# EAGLE design ShowMeShield (EAGLE 6.6.0)
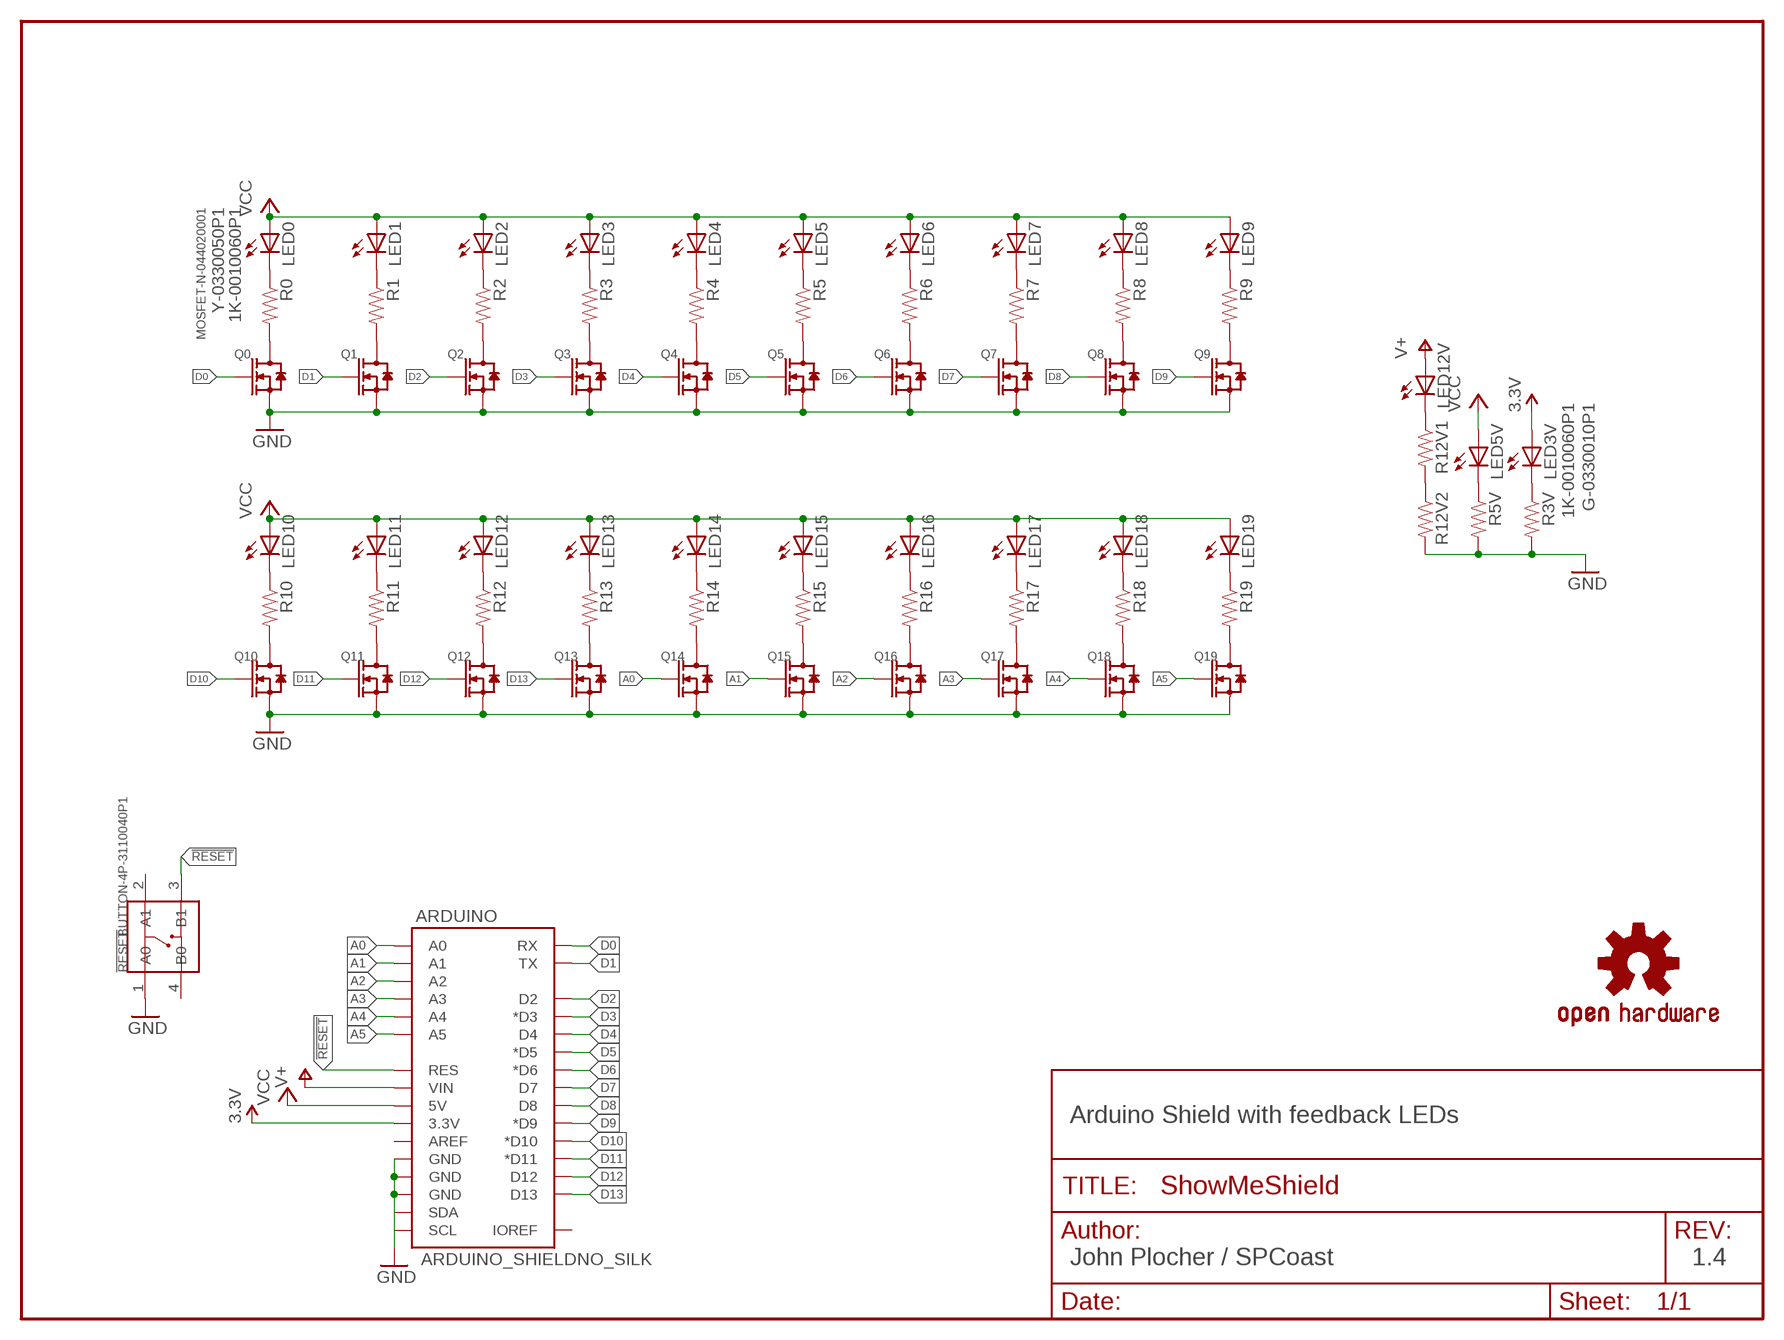
[diagram p0: schematic, sheet 1]

## Parts
!RESET  BUTTON-4P-3110040P1  [4P-6.0X6.0X5.0H]
ARDUINO  ARDUINO_SHIELDNO_SILK  [DUEMILANOVE_VIAS]
LED0  Y-0330050P1  LEDCHIPLED_0603  [CHIPLED_0603]
LED1  Y-0330050P1  LEDCHIPLED_0603  [CHIPLED_0603]
LED2  Y-0330050P1  LEDCHIPLED_0603  [CHIPLED_0603]
LED3  Y-0330050P1  LEDCHIPLED_0603  [CHIPLED_0603]
LED3V  G-0330010P1  LEDCHIPLED_0603  [CHIPLED_0603]
LED4  Y-0330050P1  LEDCHIPLED_0603  [CHIPLED_0603]
LED5  Y-0330050P1  LEDCHIPLED_0603  [CHIPLED_0603]
LED5V  G-0330010P1  LEDCHIPLED_0603  [CHIPLED_0603]
LED6  Y-0330050P1  LEDCHIPLED_0603  [CHIPLED_0603]
LED7  Y-0330050P1  LEDCHIPLED_0603  [CHIPLED_0603]
LED8  Y-0330050P1  LEDCHIPLED_0603  [CHIPLED_0603]
LED9  Y-0330050P1  LEDCHIPLED_0603  [CHIPLED_0603]
LED10  Y-0330050P1  LEDCHIPLED_0603  [CHIPLED_0603]
LED11  Y-0330050P1  LEDCHIPLED_0603  [CHIPLED_0603]
LED12  Y-0330050P1  LEDCHIPLED_0603  [CHIPLED_0603]
LED12V  G-0330010P1  LEDCHIPLED_0603  [CHIPLED_0603]
LED13  Y-0330050P1  LEDCHIPLED_0603  [CHIPLED_0603]
LED14  Y-0330050P1  LEDCHIPLED_0603  [CHIPLED_0603]
LED15  Y-0330050P1  LEDCHIPLED_0603  [CHIPLED_0603]
LED16  Y-0330050P1  LEDCHIPLED_0603  [CHIPLED_0603]
LED17  Y-0330050P1  LEDCHIPLED_0603  [CHIPLED_0603]
LED18  Y-0330050P1  LEDCHIPLED_0603  [CHIPLED_0603]
LED19  Y-0330050P1  LEDCHIPLED_0603  [CHIPLED_0603]
Q0  MOSFET-N-044020001  [SOT23]
Q1  MOSFET-N-044020001  [SOT23]
Q2  MOSFET-N-044020001  [SOT23]
Q3  MOSFET-N-044020001  [SOT23]
Q4  MOSFET-N-044020001  [SOT23]
Q5  MOSFET-N-044020001  [SOT23]
Q6  MOSFET-N-044020001  [SOT23]
Q7  MOSFET-N-044020001  [SOT23]
Q8  MOSFET-N-044020001  [SOT23]
Q9  MOSFET-N-044020001  [SOT23]
Q10  MOSFET-N-044020001  [SOT23]
Q11  MOSFET-N-044020001  [SOT23]
Q12  MOSFET-N-044020001  [SOT23]
Q13  MOSFET-N-044020001  [SOT23]
Q14  MOSFET-N-044020001  [SOT23]
Q15  MOSFET-N-044020001  [SOT23]
Q16  MOSFET-N-044020001  [SOT23]
Q17  MOSFET-N-044020001  [SOT23]
Q18  MOSFET-N-044020001  [SOT23]
Q19  MOSFET-N-044020001  [SOT23]
R0  1K-0010060P1  RESISTOR0603-RES  [0603-RES]
R1  1K-0010060P1  RESISTOR0603-RES  [0603-RES]
R2  1K-0010060P1  RESISTOR0603-RES  [0603-RES]
R3  1K-0010060P1  RESISTOR0603-RES  [0603-RES]
R3V  1K-0010060P1  RESISTOR0603-RES  [0603-RES]
R4  1K-0010060P1  RESISTOR0603-RES  [0603-RES]
R5  1K-0010060P1  RESISTOR0603-RES  [0603-RES]
R5V  1K-0010060P1  RESISTOR0603-RES  [0603-RES]
R6  1K-0010060P1  RESISTOR0603-RES  [0603-RES]
R7  1K-0010060P1  RESISTOR0603-RES  [0603-RES]
R8  1K-0010060P1  RESISTOR0603-RES  [0603-RES]
R9  1K-0010060P1  RESISTOR0603-RES  [0603-RES]
R10  1K-0010060P1  RESISTOR0603-RES  [0603-RES]
R11  1K-0010060P1  RESISTOR0603-RES  [0603-RES]
R12  1K-0010060P1  RESISTOR0603-RES  [0603-RES]
R12V1  1K-0010060P1  RESISTOR0603-RES  [0603-RES]
R12V2  1K-0010060P1  RESISTOR0603-RES  [0603-RES]
R13  1K-0010060P1  RESISTOR0603-RES  [0603-RES]
R14  1K-0010060P1  RESISTOR0603-RES  [0603-RES]
R15  1K-0010060P1  RESISTOR0603-RES  [0603-RES]
R16  1K-0010060P1  RESISTOR0603-RES  [0603-RES]
R17  1K-0010060P1  RESISTOR0603-RES  [0603-RES]
R18  1K-0010060P1  RESISTOR0603-RES  [0603-RES]
R19  1K-0010060P1  RESISTOR0603-RES  [0603-RES]
U$1  OSHW-LOGOM  [OSHW-LOGO-M]

## Nets
3.3V [Power]: ARDUINO.3.3V LED3V.A
!RESET: !RESET.3(B1) ARDUINO.RES
A0: ARDUINO.A0 Q14.1(G)
A1: ARDUINO.A1 Q15.1(G)
A2: ARDUINO.A2 Q16.1(G)
A3: ARDUINO.A3 Q17.1(G)
A4: ARDUINO.A4 Q18.1(G)
A5: ARDUINO.A5 Q19.1(G)
D0: ARDUINO.RX Q0.1(G)
D1: ARDUINO.TX Q1.1(G)
D2: ARDUINO.D2 Q2.1(G)
D3: ARDUINO.D3(*D3) Q3.1(G)
D4: ARDUINO.D4 Q4.1(G)
D5: ARDUINO.D5(*D5) Q5.1(G)
D6: ARDUINO.D6(*D6) Q6.1(G)
D7: ARDUINO.D7 Q7.1(G)
D8: ARDUINO.D8 Q8.1(G)
D9: ARDUINO.D9(*D9) Q9.1(G)
D10: ARDUINO.D10(*D10) Q10.1(G)
D11: ARDUINO.D11(*D11) Q11.1(G)
D12: ARDUINO.D12 Q12.1(G)
D13: ARDUINO.D13 Q13.1(G)
GND [Power]: !RESET.1(A0) ARDUINO.GND@0(GND) ARDUINO.GND@1(GND) ARDUINO.GND@2(GND) Q0.2(S) Q1.2(S) Q2.2(S) Q3.2(S) Q4.2(S) Q5.2(S) Q6.2(S) Q7.2(S) Q8.2(S) Q9.2(S) Q10.2(S) Q11.2(S) Q12.2(S) Q13.2(S) Q14.2(S) Q15.2(S) Q16.2(S) Q17.2(S) Q18.2(S) Q19.2(S) R3V.2 R5V.2 R12V2.2
N$1: LED3V.C R3V.1
N$2: LED1.C R1.1
N$3: LED2.C R2.1
N$4: LED3.C R3.1
N$5: LED4.C R4.1
N$6: LED5.C R5.1
N$7: LED6.C R6.1
N$8: LED5V.C R5V.1
N$9: LED7.C R7.1
N$10: R12V1.2 R12V2.1
N$11: LED8.C R8.1
N$12: LED9.C R9.1
N$13: LED10.C R10.1
N$14: LED11.C R11.1
N$15: LED12.C R12.1
N$16: LED13.C R13.1
N$17: LED14.C R14.1
N$18: LED15.C R15.1
N$19: LED16.C R16.1
N$20: LED17.C R17.1
N$21: LED18.C R18.1
N$22: LED19.C R19.1
N$23: LED12V.C R12V1.1
N$28: LED0.C R0.1
N$29: Q0.3(D) R0.2
N$30: Q1.3(D) R1.2
N$31: Q2.3(D) R2.2
N$32: Q3.3(D) R3.2
N$33: Q4.3(D) R4.2
N$34: Q5.3(D) R5.2
N$35: Q6.3(D) R6.2
N$36: Q7.3(D) R7.2
N$37: Q8.3(D) R8.2
N$38: Q9.3(D) R9.2
N$39: Q13.3(D) R13.2
N$40: Q10.3(D) R10.2
N$41: Q11.3(D) R11.2
N$42: Q12.3(D) R12.2
N$43: Q14.3(D) R14.2
N$44: Q15.3(D) R15.2
N$45: Q16.3(D) R16.2
N$46: Q17.3(D) R17.2
N$47: Q18.3(D) R18.2
N$48: Q19.3(D) R19.2
V+ [Power]: ARDUINO.VIN LED12V.A
VCC [Power]: ARDUINO.5V LED0.A LED1.A LED2.A LED3.A LED4.A LED5.A LED5V.A LED6.A LED7.A LED8.A LED9.A LED10.A LED11.A LED12.A LED13.A LED14.A LED15.A LED16.A LED17.A LED18.A LED19.A
Unconnected: !RESET.2(A1) !RESET.4(B0) ARDUINO.AREF ARDUINO.IOREF ARDUINO.SCL ARDUINO.SDA

## Notes on the sheet
- Arduino Shield with feedback LEDs
- John Plocher / SPCoast | 1.4

## Library data of the parts
!RESET = OPL:BUTTON-4P
ARDUINO = SPCoast:ARDUINO_SHIELD
LED0 LED1-LED3 LED3V LED4 LED5 LED5V LED6-LED12 LED12V LED13-LED19 = MCP:LED: LED OSRAM: - CHIPLED LG R971, LG N971, LY N971, LG Q971, LY Q971, LO R971, LY R971 LH N974, LH R974 LS Q976, LO Q976, LY Q976 LO Q996 - Hyper CHIPLED LW Q18S LB Q993, LB Q99A, LB R99A - SideLED LS A670, LO A670, LY A670, LG A670, LP A670 LB A673, LV A673, LT A673, LW A673 LH A674 LY A675 LS A676, LA A676, LO A676, LY A676, LW A676 LS A679, LY A679, LG A679 - Hyper Micro SIDELED® LS Y876, LA Y876, LO Y876, LY Y876 LT Y87S - SmartLED LW L88C, LW L88S LB L89C, LB L89S, LG L890 LS L89K, LO L89K, LY L89K LS L896, LA L896, LO L896, LY L896 - TOPLED LS T670, LO T670, LY T670, LG T670, LP T670 LSG T670, LSP T670, LSY T670, LOP T670, LYG T670 LG T671, LOG T671, LSG T671 LB T673, LV T673, LT T673, LW T673 LH T674 LS T676, LA T676, LO T676, LY T676, LB T676, LH T676, LSB T676, LW T676 LB T67C, LV T67C, LT T67C, LS T67K, LO T67K, LY T67K, LW E67C LS E67B, LA E67B, LO E67B, LY E67B, LB E67C, LV E67C, LT E67C LW T67C LS T679, LY T679, LG T679 LS T770, LO T770, LY T770, LG T770, LP T770 LB T773, LV T773, LT T773, LW T773 LH T774 LS E675, LA E675, LY E675, LS T675 LS T776, LA T776, LO T776, LY T776, LB T776 LHGB T686 LT T68C, LB T68C - Hyper Mini TOPLED® LB M676 - Mini TOPLED Santana® LG M470 LS M47K, LO M47K, LY M47K Source: http://www.osram.convergy.de LUXEON: - LUMILED® LXK2-PW12-R00, LXK2-PW12-S00, LXK2-PW14-U00, LXK2-PW14-V00 LXK2-PM12-R00, LXK2-PM12-S00, LXK2-PM14-U00 LXK2-PE12-Q00, LXK2-PE12-R00, LXK2-PE12-S00, LXK2-PE14-T00, LXK2-PE14-U00 LXK2-PB12-K00, LXK2-PB12-L00, LXK2-PB12-M00, LXK2-PB14-N00, LXK2-PB14-P00, LXK2-PB14-Q00 LXK2-PR12-L00, LXK2-PR12-M00, LXK2-PR14-Q00, LXK2-PR14-R00 LXK2-PD12-Q00, LXK2-PD12-R00, LXK2-PD12-S00 LXK2-PH12-R00, LXK2-PH12-S00 LXK2-PL12-P00, LXK2-PL12-Q00, LXK2-PL12-R00 Source: www.luxeon.com KINGBRIGHT: KA-3528ASYC Source: www.kingbright.com
Q0 Q1-Q19 = OPL:MOSFET-N: CJ2302：SMD MOSFET N-CH 20V-2.1A
R0 R1-R3 R3V R4 R5 R5V R6-R12 R12V1 R12V2 R13-R19 = MCP:RESISTOR: Resistor Basic schematic elements and footprints for 0603, 1206, and PTH 1/10th watt (small) resistors.
U$1 = SparkFun:OSHW-LOGO: Open Source Hardware Logo This logo indicates the piece of hardware it is found on incorporates a OSHW license and/or adheres to the definition of open source hardware found here: http://freedomdefined.org/OSHW

## Net classes
0 default: width 0.254 mm, drill 0.203 mm
1 Power: width 0.305 mm, drill 0.203 mm

## Board
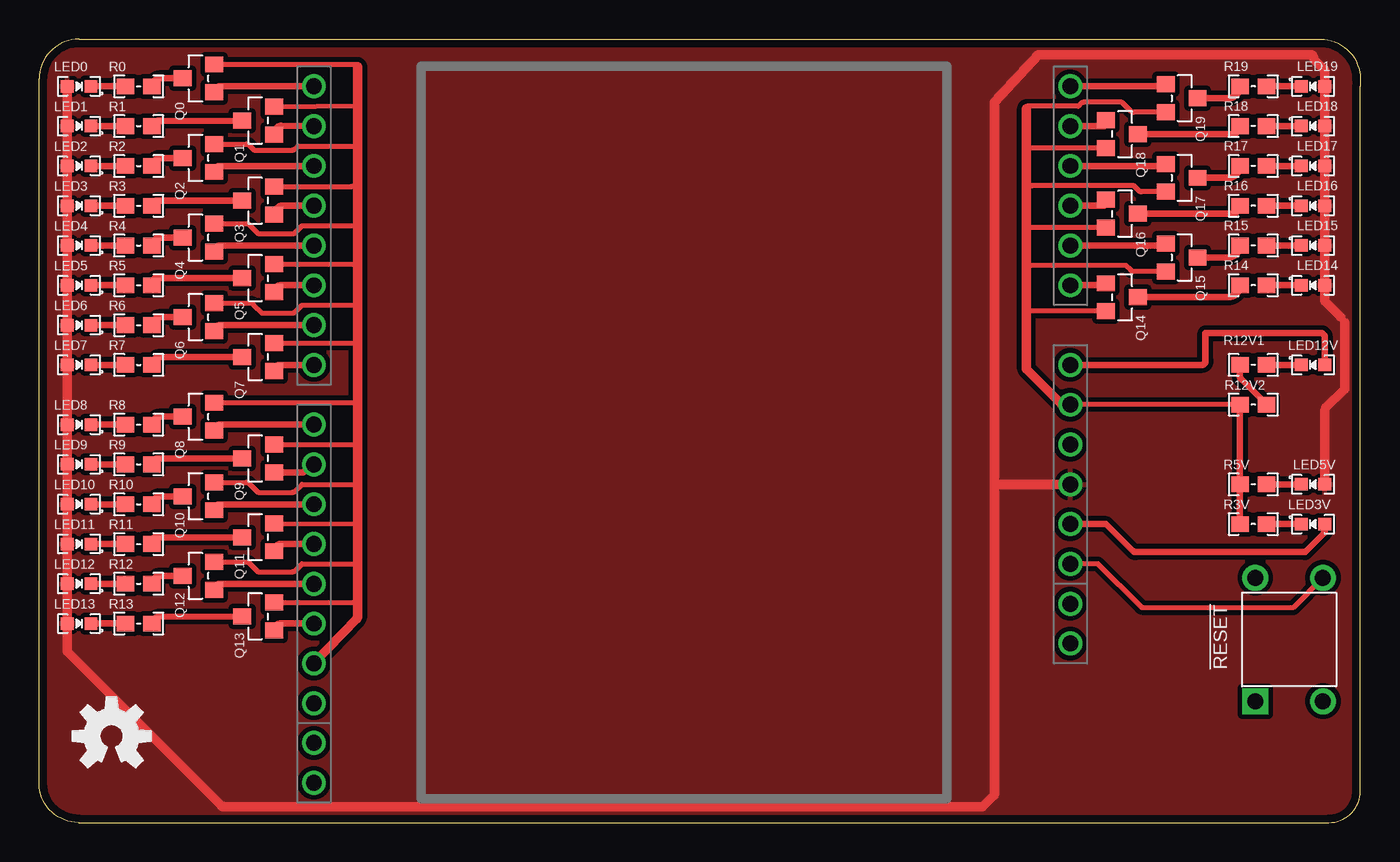
[diagram p1: board, top side]
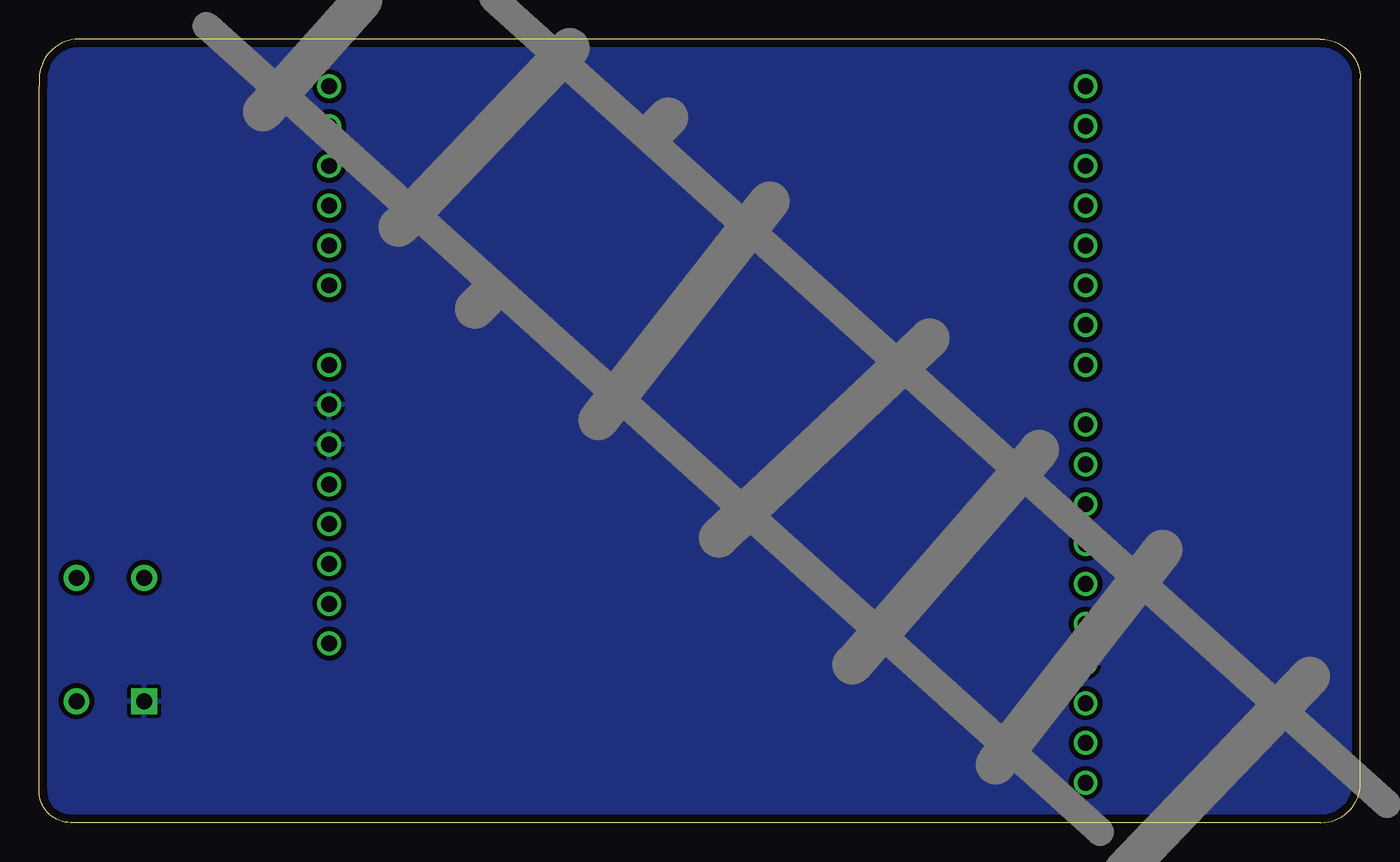
[diagram p2: board, bottom side, seen from below]

Size 84.3 x 50 mm. Coordinates in mm from the lower left corner, seen from the top.
Outline: 81.29,50 2.55,50 arc90 0,47.47 0,2.5 arc90 2.51,0 82.3,0 arc90 84.29,2 84.29,47
Outline: 81.3,50 81.76,50 arc-90 84.29,47.47 84.3,47.01
Copper layers (1*16): Top 0.035mm / dielectric 1.5mm / Bottom 0.035mm
Design rules "default *": minimum track width 10mil, minimum drill 0.6mm, track to track 8mil, track to pad 8mil, pad to pad 8mil, via to via 8mil, smd to smd 8mil, copper to edge 20mil, drill to drill 10mil, minimum pad ring 10mil, minimum via ring 8mil, stop-mask expansion 4mil, vias tented up to drill 0mil, thermal gap 10mil

### Footprints (pad centres in the part's own frame; a part is rotated, then mirrored left to right if it is on the bottom)
4P-6.0X6.0X5.0H = drill 1.016 pad 1.651 square: 1 -3.937,2.159 | drill 1.016 pad 1.651: 2 -3.937,-2.159; 3 3.937,-2.159; 4 3.937,2.159
DUEMILANOVE_VIAS = drill 1.016: 3.3V 49.53,17.78; 5V 49.53,20.32; A0 49.53,33.02; A1 49.53,35.56; A2 49.53,38.1; A3 49.53,40.64; A4 49.53,43.18; A5 49.53,45.72; AREF 1.27,6.35; D2 1.27,40.64; D3 1.27,38.1; D4 1.27,35.56; D5 1.27,33.02; D6 1.27,30.48; D7 1.27,27.94; D8 1.27,24.13; D9 1.27,21.59; D10 1.27,19.05; D11 1.27,16.51; D12 1.27,13.97; D13 1.27,11.43; GND@0 49.53,22.86; GND@1 49.53,25.4; GND@2 1.27,8.89; IOREF 49.53,12.7; NC1 49.53,10.16; RES 49.53,15.24; RX 1.27,45.72; SCL 1.27,1.27; SDA 1.27,3.81; TX 1.27,43.18; VIN 49.53,27.94
CHIPLED_0603 = smd 0.8 x 0.8: A 0,-0.75; C 0,0.75
SOT23 = smd 1.016 x 1.143: 1 -0.889,-1.016; 2 0.889,-1.016; 3 0,1.016
0603-RES = smd 1.1 x 1: 1 -0.85,0; 2 0.85,0

### Placement (x,y rotation side)
!RESET  79.76,11.68 90 top
ARDUINO  16.26,1.27 0 top
LED0  2.54,46.99 270 top
LED1  2.54,44.45 270 top
LED2  2.54,41.91 270 top
LED3  2.54,39.37 270 top
LED3V  81.28,19.05 90 top
LED4  2.54,36.83 270 top
LED5  2.54,34.29 270 top
LED5V  81.28,21.59 90 top
LED6  2.54,31.75 270 top
LED7  2.54,29.21 270 top
LED8  2.54,25.4 270 top
LED9  2.54,22.86 270 top
LED10  2.54,20.32 270 top
LED11  2.54,17.78 270 top
LED12  2.54,15.24 270 top
LED12V  81.28,29.21 90 top
LED13  2.54,12.7 270 top
LED14  81.28,34.29 90 top
LED15  81.28,36.83 90 top
LED16  81.28,39.37 90 top
LED17  81.28,41.91 90 top
LED18  81.28,44.45 90 top
LED19  81.28,46.99 90 top
Q0  10.16,47.5 90 top
Q1  13.97,44.81 90 top
Q2  10.16,42.42 90 top
Q3  13.97,39.7 90 top
Q4  10.16,37.34 90 top
Q5  13.97,34.75 90 top
Q6  10.16,32.26 90 top
Q7  13.97,29.72 90 top
Q8  10.16,25.91 90 top
Q9  13.97,23.24 90 top
Q10  10.16,20.83 90 top
Q11  13.97,18.21 90 top
Q12  10.16,15.75 90 top
Q13  13.97,13.16 90 top
Q14  69.09,33.53 270 top
Q15  72.9,36.07 270 top
Q16  69.09,38.86 270 top
Q17  72.9,41.15 270 top
Q18  69.09,43.94 270 top
Q19  72.9,46.23 270 top
R0  6.35,46.99 0 top
R1  6.35,44.45 0 top
R2  6.35,41.91 0 top
R3  6.35,39.37 0 top
R3V  77.47,19.05 180 top
R4  6.35,36.83 0 top
R5  6.35,34.29 0 top
R5V  77.47,21.59 180 top
R6  6.35,31.75 0 top
R7  6.35,29.21 0 top
R8  6.35,25.4 0 top
R9  6.35,22.86 0 top
R10  6.35,20.32 0 top
R11  6.35,17.78 0 top
R12  6.35,15.24 0 top
R12V1  77.47,29.21 180 top
R12V2  77.47,26.67 180 top
R13  6.35,12.7 0 top
R14  77.47,34.29 180 top
R15  77.47,36.83 180 top
R16  77.47,39.37 180 top
R17  77.47,41.91 180 top
R18  77.47,44.45 180 top
R19  77.47,46.99 180 top
U$1  4.62,5.51 0 top

### Tracks (layer width: path | path; a pad name or v marks a point on that pad's centre or on a via)
3.3V
  Top 0.406: LED3V.A 82.03,18.64 arc-45 81.96,18.46 80.77,17.27 69.95,17.27 arc-45 69.78,17.35 68.07,19.05 ARDUINO.3.3V
!RESET
  Top 0.305: !RESET.3 80.01,13.72 70.46,13.72 arc-45 70.28,13.79 67.56,16.51 ARDUINO.RES
A0
  Top 0.406: ARDUINO.A0 67.94,34.29 arc90 Q14.1
A1
  Top 0.406: ARDUINO.A1 71.75,36.83 arc90 Q15.1
A2
  Top 0.406: ARDUINO.A2 67.94,39.37 arc90 Q16.1
A3
  Top 0.406: ARDUINO.A3 71.75,41.91 arc90 Q17.1
A4
  Top 0.406: 67.94,44.45 arc90 Q18.1 arc-90 67.69,44.45 ARDUINO.A4
A5
  Top 0.406: ARDUINO.A5 71.75,46.99 arc90 Q19.1
D0
  Top 0.406: ARDUINO.RX 11.56,46.99 arc90 Q0.1
D1
  Top 0.406: ARDUINO.TX 15.44,44.48 arc90 Q1.1
D2
  Top 0.406: ARDUINO.D2 11.56,41.91 arc90 Q2.1
D3
  Top 0.406: ARDUINO.D3 15.54,39.37 arc90 Q3.1
D4
  Top 0.406: ARDUINO.D4 11.56,36.83 arc90 Q4.1
D5
  Top 0.406: ARDUINO.D5 15.42,34.29 arc90 Q5.1
D6
  Top 0.406: ARDUINO.D6 11.56,31.75 arc90 Q6.1
D7
  Top 0.406: ARDUINO.D7 15.37,29.21 arc90 Q7.1
D8
  Top 0.406: ARDUINO.D8 11.56,25.4 arc90 Q8.1
D9
  Top 0.406: Q9.1 16.79,22.35 arc45 16.96,22.43 ARDUINO.D9
D10
  Top 0.406: ARDUINO.D10 11.56,20.32 arc90 Q10.1
D11
  Top 0.406: ARDUINO.D11 15.44,17.78 arc90 Q11.1
D12
  Top 0.406: ARDUINO.D12 11.56,15.24 arc90 Q12.1
D13
  Top 0.406: ARDUINO.D13 15.37,12.7 arc90 Q13.1
GND
  Top 0.305: Q0.2 20.34,48.39 arc-45 20.27,48.31 20.32,48.23 | Q1.2 20.34,45.74 arc-45 20.27,45.77 20.32,45.72 | Q2.2 13.23,43.31 arc-45 13.41,43.23 13.72,42.93 16.15,42.93 arc45 16.33,43 16.51,43.18 20.32,43.18 | Q3.2 19.91,40.59 arc45 20.09,40.66 20.32,40.89 | Q5.2 20.04,35.64 arc45 20.22,35.71 20.32,35.81 | Q7.2 20.09,30.61 arc-45 20.27,30.53 20.32,30.48 | Q4.2 13.23,38.23 arc-45 13.41,38.15 13.97,37.59 16.26,37.59 16.76,38.1 20.32,38.1 | Q6.2 13.48,33.15 arc-45 13.66,33.07 14.22,32.51 16.15,32.51 arc45 16.33,32.59 16.76,33.02 20.32,33.02 | Q8.2 20.32,26.8 | Q9.2 20.32,24.13 | Q11.2 20.32,19.05 | Q10.2 13.23,21.72 arc-45 13.41,21.64 13.97,21.08 16.15,21.08 arc45 16.33,21.16 16.76,21.59 20.32,21.59 | Q12.2 13.23,16.64 arc-45 13.41,16.56 13.97,16 16.15,16 arc45 16.33,16.08 16.76,16.51 20.32,16.51 | Q13.2 20.14,14.05 arc-45 20.32,13.97 | Q19.2 69.83,45.34 arc-45 69.65,45.41 69.09,45.97 66.65,45.97 arc45 66.47,45.9 66.29,45.72 63.02,45.72 62.99,45.64 62.99,45.57 | Q18.2 63.22,43.05 arc-45 63.05,43.13 62.99,43.18 | Q16.2 63.22,37.97 arc-45 63.05,38.05 62.99,38.1 | Q14.2 63.22,32.64 arc45 63.05,32.56 62.99,32.51 | Q15.2 69.83,35.18 arc-45 69.65,35.25 69.34,35.56 62.99,35.56 | Q17.2 70.34,40.26 arc-45 70.16,40.33 69.85,40.64 63.35,40.64 arc-45 63.17,40.71 62.99,40.89 | R12V2.2 ARDUINO.GND@1
  Top 0.406: R12V2.2 R5V.2 R3V.2
  Top 0.61: 20.32,48.23 20.32,45.72 20.32,43.18 20.32,40.89 20.32,38.1 20.32,35.81 20.32,33.02 20.32,30.48 20.32,26.8 20.32,24.13 20.32,21.59 20.32,19.05 20.32,16.51 20.32,13.97 20.32,13.19 arc-45 20.25,13.01 ARDUINO.GND@2 | ARDUINO.GND@1 65.38,26.67 arc-45 65.2,26.74 62.99,28.96 62.99,32.51 62.99,35.56 62.99,38.1 62.99,40.89 62.99,43.18 62.99,45.57
  pour Bottom (isolate 0.305): 0,0 84.29,0 84.29,50 0,50
N$1
  Top 0.406: LED3V.C R3V.1
N$2
  Top 0.406: R1.1 LED1.C
N$3
  Top 0.406: R2.1 LED2.C
N$4
  Top 0.406: R3.1 LED3.C
N$5
  Top 0.406: R4.1 LED4.C
N$6
  Top 0.406: R5.1 LED5.C
N$7
  Top 0.406: R6.1 LED6.C
N$8
  Top 0.406: LED5V.C R5V.1
N$9
  Top 0.406: R7.1 LED7.C
N$10
  Top 0.406: R12V1.2 76.62,28.48 arc45 76.69,28.3 R12V2.1
N$11
  Top 0.406: R8.1 LED8.C
N$12
  Top 0.406: R9.1 LED9.C
N$13
  Top 0.406: R10.1 LED10.C
N$14
  Top 0.406: R11.1 LED11.C
N$15
  Top 0.406: R12.1 LED12.C
N$16
  Top 0.406: R13.1 LED13.C
N$17
  Top 0.406: R14.1 LED14.C
N$18
  Top 0.406: R15.1 LED15.C
N$19
  Top 0.406: R16.1 LED16.C
N$20
  Top 0.406: R17.1 LED17.C
N$21
  Top 0.406: R18.1 LED18.C
N$22
  Top 0.406: R19.1 LED19.C
N$23
  Top 0.406: LED12V.C R12V1.1
N$28
  Top 0.406: R0.1 LED0.C
N$29
  Top 0.406: Q0.3 7.71,47.5 arc90 R0.2
N$30
  Top 0.406: Q1.3 7.78,44.78 arc90 R1.2
N$31
  Top 0.406: Q2.3 7.71,42.42 arc90 R2.2
N$32
  Top 0.406: Q3.3 7.53,39.7 arc90 R3.2
N$33
  Top 0.406: Q4.3 7.71,37.34 arc90 R4.2
N$34
  Top 0.406: Q5.3 7.4,34.75 arc90 R5.2
N$35
  Top 0.406: Q6.3 7.71,32.26 arc90 R6.2
N$36
  Top 0.406: Q7.3 7.71,29.72 arc90 R7.2
N$37
  Top 0.406: Q8.3 7.71,25.91 arc90 R8.2
N$38
  Top 0.406: Q9.3 7.58,23.24 arc90 R9.2
N$39
  Top 0.406: Q13.3 7.68,13.13 arc90 R13.2
N$40
  Top 0.406: Q10.3 7.71,20.83 arc90 R10.2
N$41
  Top 0.406: Q11.3 7.38,18.21 arc90 R11.2
N$42
  Top 0.406: Q12.3 7.71,15.75 arc90 R12.2
N$43
  Top 0.406: Q14.3 75.86,33.53 arc90 R14.2
N$44
  Top 0.406: Q15.3 75.86,36.07 arc90 R15.2
N$45
  Top 0.406: Q16.3 76.11,38.86 arc90 R16.2
N$46
  Top 0.406: Q17.3 75.86,41.15 arc90 R17.2
N$47
  Top 0.406: Q18.3 76.11,43.94 arc90 R18.2
N$48
  Top 0.406: Q19.3 75.86,46.23 arc90 R19.2
V+
  Top 0.406: ARDUINO.VIN 74.17,29.21 arc90 74.42,29.46 74.42,31.24 81.78,31.24 arc-90 82.03,30.99 LED12V.A
VCC
  Top 0.406: 82.03,26.3 arc-45 82.1,26.48 | 83.31,31.9 arc45 83.24,32.08 83.06,32.26 | 82.04,34.26 arc45 LED14.A
  Top 0.61: LED0.A LED1.A LED2.A LED3.A LED4.A LED5.A LED6.A LED7.A LED8.A LED9.A LED10.A LED11.A LED12.A LED13.A arc45 1.78,12.67 1.78,10.92 11.61,1.09 arc45 11.79,1.02 60.2,1.02 60.89,1.7 arc45 60.96,1.88 60.96,21.59 | LED14.A LED15.A LED16.A LED17.A LED18.A LED19.A arc45 82.04,47.02 82.04,48.01 81.35,48.69 arc45 81.17,49.02 63.75,49.02 60.96,45.97 60.96,21.59 | LED5V.A 82.03,26.3 | 82.1,26.48 83.31,27.69 83.31,31.9 | 83.06,32.26 82.04,33.27 82.04,34.26 | ARDUINO.5V 60.96,21.59
  pour Top (isolate 0.305): 0,0 84.29,0 84.29,50 0,50

### Text on the board
tDocu: ShowMe | Vin | Gnd | Gnd | 5v | 3.3 | Shield | SPCoast | Open Source | 2013.10 | 2014.07 | RESET | John Plocher | Hardware | ShowMe Shield | V1.5
bDocu: www.SPCoast.com | CC-by-SA License | John Plocher | Go Bears! | SPCoast | 2014.07 | Designed in the PCR, Coast Division, NMRA | Model Railroading is fun! | ShowMeShield